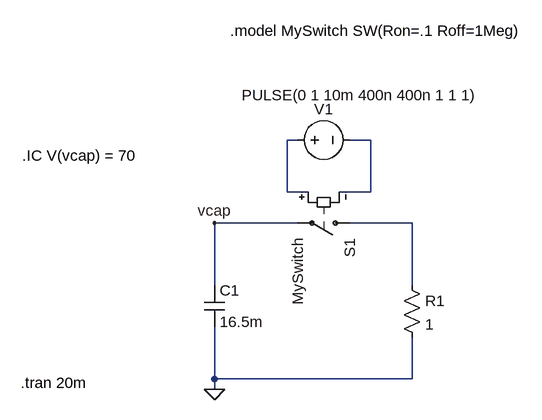
[diagram p0: schematic Draft2.asc]
Draft2.asc, the LTspice schematic file:
Version 4
SHEET 1 944 680
WIRE 192 -64 176 -64
WIRE 304 -64 272 -64
WIRE 176 16 176 -64
WIRE 208 16 176 16
WIRE 304 16 304 -64
WIRE 304 16 256 16
WIRE 192 64 64 64
WIRE 368 64 272 64
WIRE 64 160 64 64
WIRE 368 160 368 64
WIRE 64 304 64 224
WIRE 368 304 368 240
WIRE 368 304 64 304
WIRE 64 320 64 304
FLAG 64 64 vcap
FLAG 64 320 0
SYMBOL cap 48 160 R0
SYMATTR InstName C1
SYMATTR Value 16.5m
SYMBOL res 352 144 R0
SYMATTR InstName R1
SYMATTR Value 1
SYMBOL sw 288 64 R90
SYMATTR InstName S1
SYMATTR Value MySwitch
SYMBOL voltage 176 -64 R270
WINDOW 0 32 56 VTop 2
WINDOW 3 85 112 VBottom 2
WINDOW 123 0 0 Left 0
WINDOW 39 0 0 Left 0
SYMATTR InstName V1
SYMATTR Value PULSE(0 1 10m 400n 400n 1 1 1)
TEXT -232 -40 Left 2 !.IC V(vcap) = 70
TEXT -234 310 Left 2 !.tran 20m
TEXT 88 -232 Left 2 !.model MySwitch SW(Ron=.1 Roff=1Meg)

The netlist it stands for:
* Draft2.asc
C1 vcap 0 16.5m
R1 N003 0 1
S1 N003 vcap N001 N002 MySwitch
V1 N001 N002 PULSE(0 1 10m 400n 400n 1 1 1)
.IC V(vcap) = 70
.tran 20m
.model MySwitch SW(Ron=.1 Roff=1Meg)
.backanno
.end